# EAGLE design mixer (EAGLE 7.5.0)
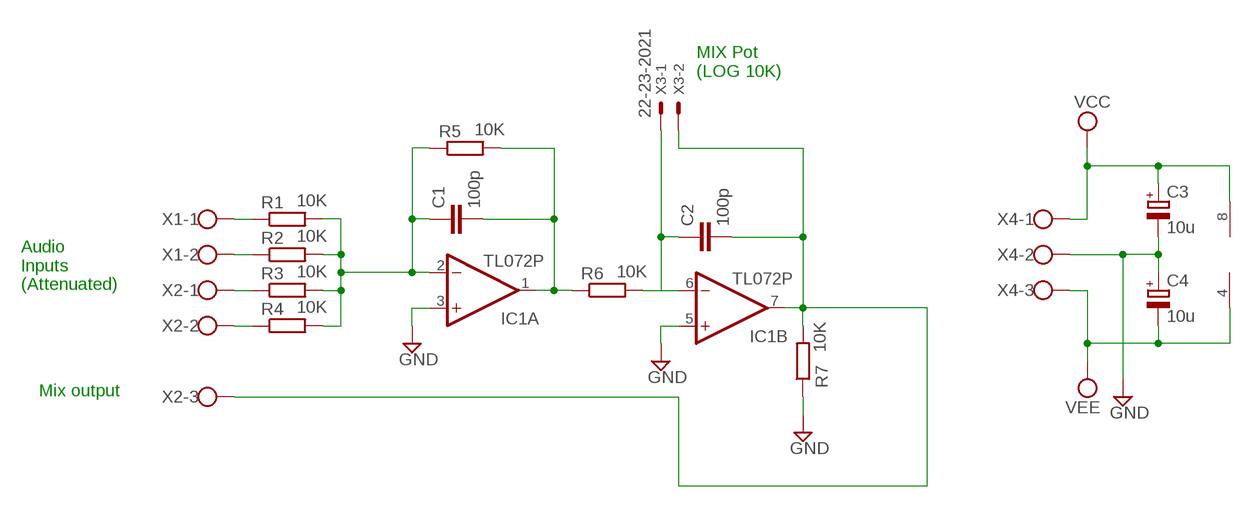
[diagram p0: schematic, sheet 1]

## Parts
C1  100p  C-EU025-024X044  [C025-024X044]
C2  100p  C-EU025-024X044  [C025-024X044]
C3  10u  CPOL-EUE1.8-4  [E1,8-4]
C4  10u  CPOL-EUE1.8-4  [E1,8-4]
IC1  TL072P  [DIL08]
R1  10K  R-EU_0204/7  [0204/7]
R2  10K  R-EU_0204/7  [0204/7]
R3  10K  R-EU_0204/7  [0204/7]
R4  10K  R-EU_0204/7  [0204/7]
R5  10K  R-EU_0204/7  [0204/7]
R6  10K  R-EU_0204/7  [0204/7]
R7  10K  R-EU_0204/7  [0204/7]
X1  W237-102  [W237-102]
X2  W237-103  [W237-103]
X3  22-23-2021  [22-23-2021]
X4  W237-103  [W237-103]

## Nets
GND: C3.- C4.+ IC1.3(A:+IN) IC1.5(B:+IN) R7.1 X4.2
N$2: R1.1 X1.1
N$3: R2.1 X1.2
N$4: R3.1 X2.1
N$5: R4.1 X2.2
N$6: C1.1 IC1.2(A:-IN) R1.2 R2.2 R3.2 R4.2 R5.1
N$8: C1.2 IC1.1(A:OUT) R5.2 R6.1
N$13: C2.1 IC1.6(B:-IN) R6.2 X3.1
N$15: C2.2 IC1.7(B:OUT) R7.2 X2.3 X3.2
VCC: C3.+ IC1.8(P:V+) X4.1
VEE: C4.- IC1.4(P:V-) X4.3

## Notes on the sheet
- MIX Pot
  (LOG 10K)
- Audio
  Inputs
  (Attenuated)
- Mix output

## Library data of the parts
C1 C2 = rcl:C-EU: CAPACITOR, European symbol
C3 C4 = rcl:CPOL-EU: POLARIZED CAPACITOR, European symbol
IC1 = linear:TL072: OP AMP
R1-R7 = rcl:R-EU_: RESISTOR, European symbol
X1 = con-wago-500:W237-102: WAGO SCREW CLAMP; MPN: 237-102; OC_FARNELL: unknown; OC_NEWARK: 70K9898
X2 X4 = con-wago-500:W237-103: WAGO SCREW CLAMP; MPN: 237-103; OC_FARNELL: unknown; OC_NEWARK: 18M7116
X3 = con-molex:22-23-2021: .100" (2.54mm) Center Header - 2 Pin; MF: MOLEX; MPN: 22-23-2021; OC_FARNELL: 1462926; OC_NEWARK: 25C3832

## Board
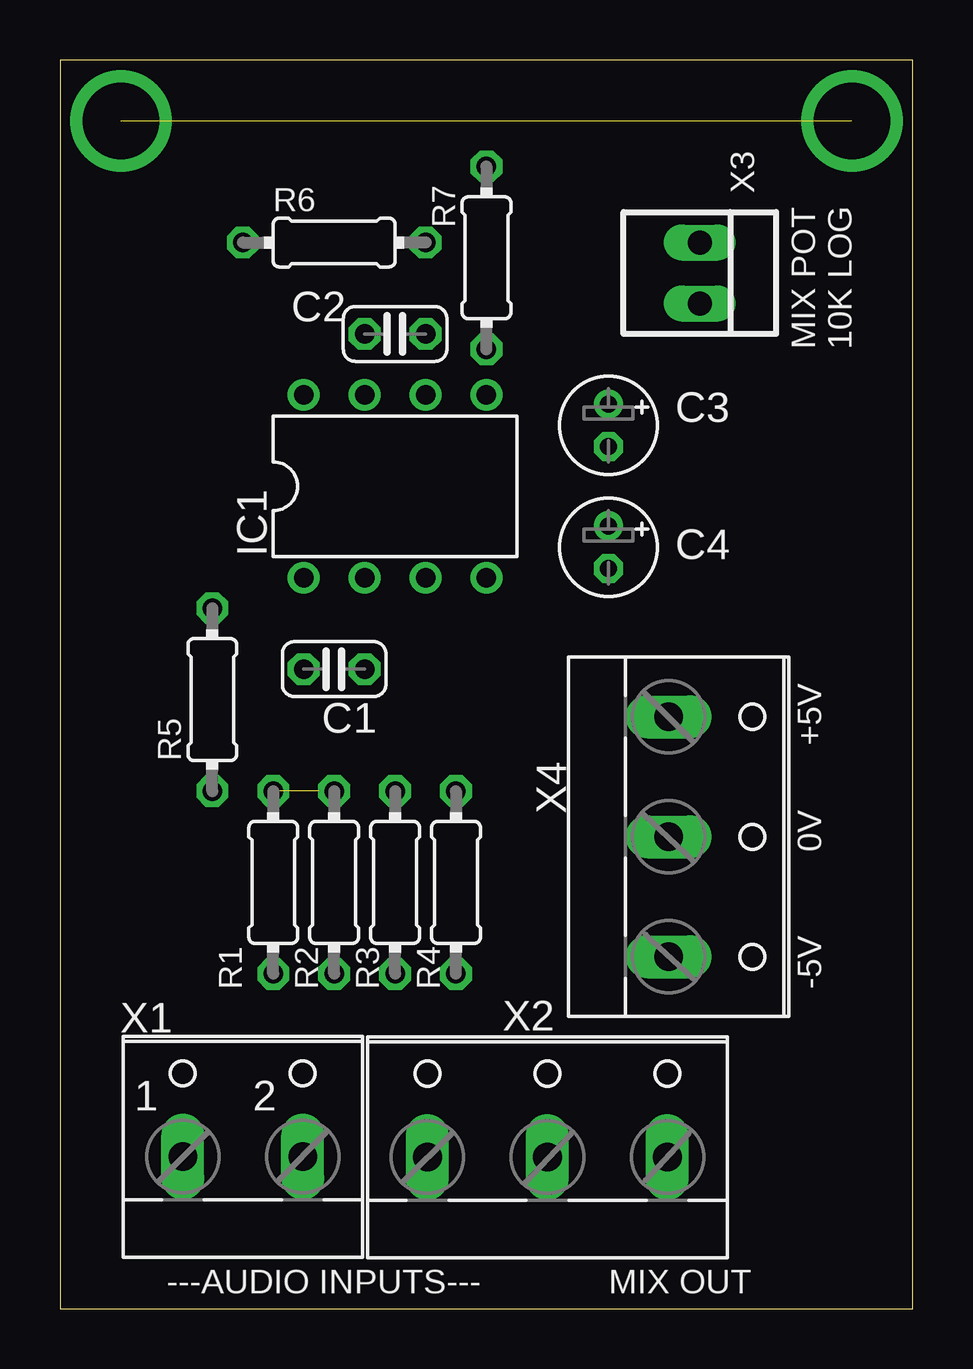
[diagram p1: board, top side]
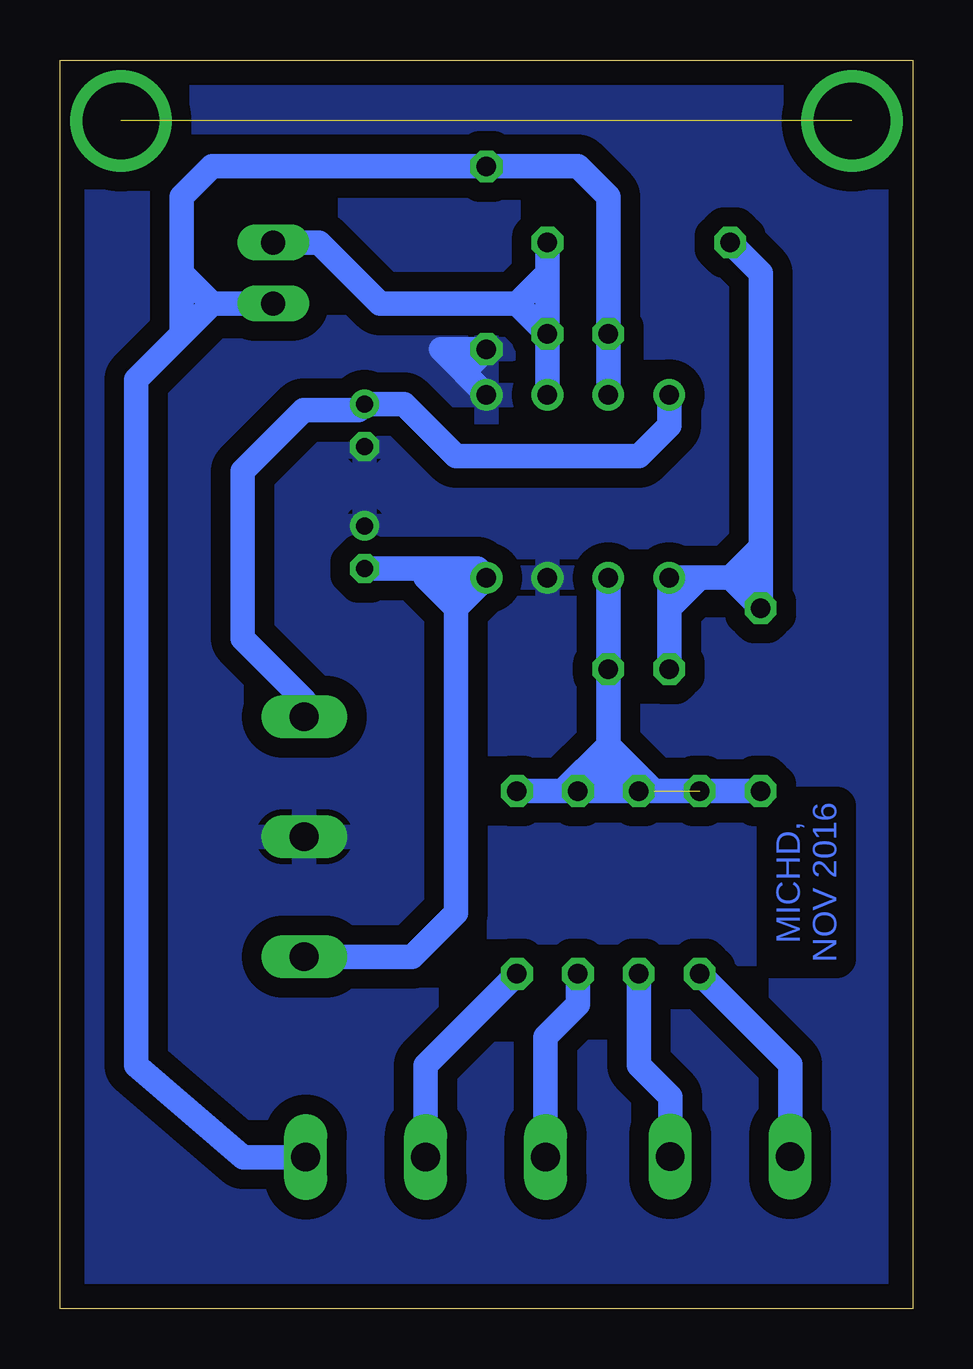
[diagram p2: board, bottom side, seen from below]

Size 35.56 x 52.06 mm. Coordinates in mm from the lower left corner, seen from the top.
Outline: 0,0 35.56,0 35.56,52.06 0,52.06 0,0
Copper layers (1*16): Top 0.035mm / dielectric 1.5mm / Bottom 0.035mm
Design rules "default": minimum track width 10mil, minimum drill 24mil, track to track 8mil, track to pad 8mil, pad to pad 8mil, via to via 8mil, smd to smd 8mil, copper to edge 40mil, drill to drill 8mil, minimum pad ring 10mil, minimum via ring 8mil, stop-mask expansion 4mil, vias tented up to drill 0mil, thermal gap 10mil

### Footprints (pad centres in the part's own frame; a part is rotated, then mirrored left to right if it is on the bottom)
C025-024X044 = drill 0.813 octagon: 1 -1.27,0; 2 1.27,0
E1,8-4 = drill 0.711 pad 1.168: + -0.889,0 | drill 0.711 pad 1.168 octagon: - 0.889,0
DIL08 = drill 0.813 pad 1.27: 1 -3.81,-3.81; 2 -1.27,-3.81; 3 1.27,-3.81; 4 3.81,-3.81; 5 3.81,3.81; 6 1.27,3.81; 7 -1.27,3.81; 8 -3.81,3.81
0204/7 = drill 0.813 octagon: 1 -3.81,0; 2 3.81,0
W237-102 = drill 1.194 long: 1 -2.5,-1.27; 2 2.5,-1.27
W237-103 = drill 1.194 long: 1 -5,-1.29; 2 0,-1.29; 3 5,-1.29
22-23-2021 = drill 1 long: 1 -1.27,0; 2 1.27,0

### Placement (x,y rotation side)
C1  11.43,26.67 180 top
C2  13.97,40.64 180 top
C3  22.86,36.83 270 top
C4  22.86,31.75 270 top
IC1  13.97,34.29 0 top
R1  8.89,17.78 90 top
R2  11.43,17.78 90 top
R3  13.97,17.78 90 top
R4  16.51,17.78 90 top
R5  6.35,25.4 90 top
R6  11.43,44.45 0 top
R7  17.78,43.81 90 top
X1  7.62,7.62 0 top
X2  20.32,7.62 0 top
X3  26.67,43.18 270 top
X4  26.67,19.68 270 top

### Tracks (layer width: path | path; a pad name or v marks a point on that pad's centre or on a via)
GND
  Bottom 1.016: IC1.5 19.68,40.01 R7.1 18.41,39.37
  pour Bottom (isolate 0.813): 1.27,52.07 35.56,52.07 35.56,1.27 1.27,1.27
N$1
  pour Bottom (isolate 0.813): 0,52.07 35.56,52.07 35.56,0 0,0
N$2
  Bottom 1.016: X1.1 5.12,10.2 R1.1
N$3
  Bottom 1.016: X1.2 10.12,8.85 11.43,10.16 R2.1
N$4
  Bottom 1.016: X2.1 15.32,11.35 13.97,12.7 R3.1
N$5
  Bottom 1.016: X2.2 20.32,10.16 R4.1
N$6  (1 unrouted)
  Bottom 1.016: R5.1 10.79,21.59 | 10.79,21.59 R2.2 12.7,21.59 | 12.7,21.59 13.34,21.59 | 13.34,21.59 R3.2 14.61,21.59 | 14.61,21.59 R4.2 | 12.7,23.5 C1.1 IC1.2 | 12.7,23.5 12.7,21.59 | 10.79,21.59 12.7,23.5 | 12.7,23.5 14.61,21.59 | 13.34,21.59 13.34,22.23 12.06,22.23
N$8
  Bottom 1.016: C1.2 10.16,29.21 | 10.16,29.21 IC1.1 8.89,30.48 | 6.35,30.48 R5.2 7.62,30.48 | 6.35,30.48 7.62,30.48 | 6.35,30.48 6.35,31.75 | 6.35,31.75 6.35,43.18 R6.1 | 6.35,31.75 7.62,30.48 | 7.62,30.48 8.89,30.48 | 8.89,30.48 10.16,29.21
N$13
  Bottom 1.016: IC1.6 C2.1 | X3.1 24.77,44.45 22.23,41.91 16.51,41.91 | 16.51,41.91 C2.1 | R6.2 15.24,43.18 | 15.24,43.18 C2.1 | 16.51,41.91 15.24,43.18
N$15
  Bottom 1.016: IC1.7 C2.2 12.7,46.35 13.97,47.62 R7.2 29.21,47.62 30.48,46.35 30.48,43.18 | X3.2 29.21,41.91 | 29.21,41.91 30.48,43.18 | X2.3 27.92,6.33 32.38,10.16 32.38,38.73 30.48,40.64 | 30.48,40.64 29.21,41.91 | 30.48,43.18 30.48,40.64
N$32  (via drill 3.2 pad 3.81)  (1 unrouted)
  other vias: 2.54,49.52 33.02,49.52
VCC
  Bottom 1.016: IC1.8 10.16,36.83 11.43,35.56 19.05,35.56 21.21,37.72 C3.+ 23.11,37.47 25.4,37.47 27.94,34.92 27.94,27.94 25.38,25.38 X4.1
VEE
  Bottom 1.016: C4.- 19.05,30.86 | 19.05,30.86 18.16,30.86 IC1.4 19.05,29.21 | X4.3 20.88,14.69 19.05,16.51 19.05,29.21 | 19.05,29.21 19.05,30.86 | 19.05,29.21 20.32,30.48

### Text on the board
Bottom: MICHD, / NOV 2016
tNames: MIX POT / 10K LOG | +5V | 0V | -5V | ---AUDIO INPUTS--- | MIX OUT